# Altium project DDS_Generator.PrjPcb
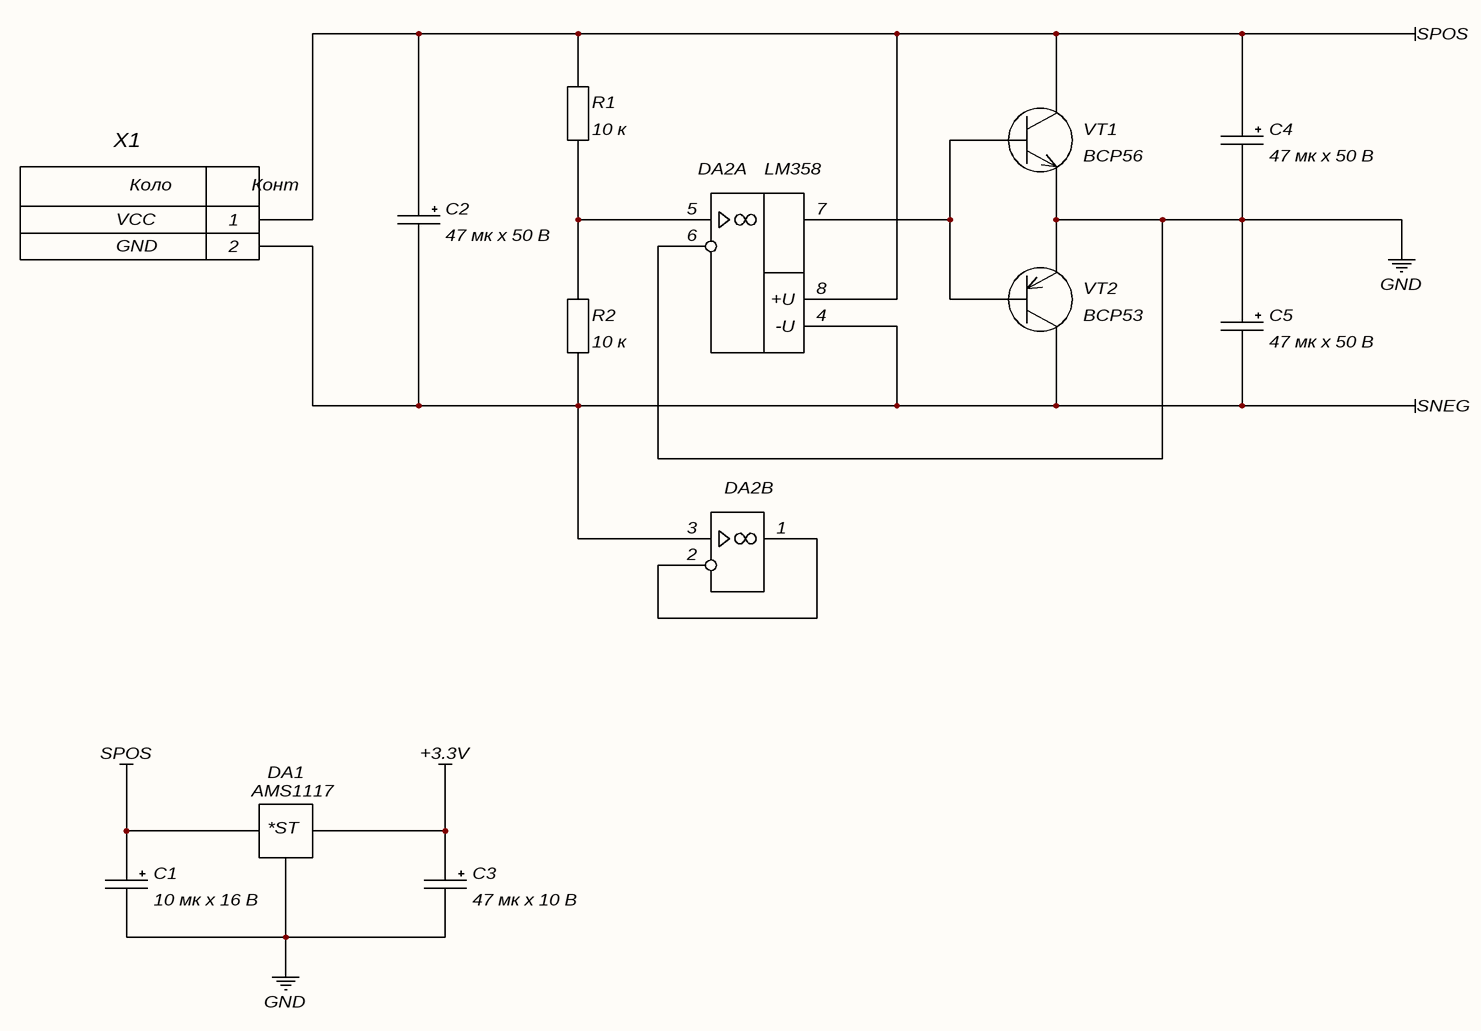
[diagram p0: 1_Power.SchDoc]
Документация0: А2#РІ91.468789.001 СК#Сборочный чертеж (СБ)#СБ##; Документация1: А2#РІ91.468789.001 ЕЗ#Схема электрическая принципиальная (Э3)#Э3##; Материалы0: Паста паяльная 7020 ТУ-005-00387275-2007 (г)##г##; Материалы1: Припой ПОС-61 ГОСТ 21931-76 (г)##г##
3 sheets, 69 parts. Net scope: global (net labels, ports and power ports of the same name join across sheets).
Board file: DDS_Generator.PcbDoc
Sheets:
  1_Power.SchDoc
  2_MCU.SchDoc
  3_RF.SchDoc

## Sheet 1_Power.SchDoc
size 420 x 297 mm; SheetNumber: 1; SheetTotal: 3; Rozrobyv: Іванченко А.; Pereviryv: Адаменко Ю.; Zatverdyv: Адаменко Ю.; Oboznachennia: РІ91.468789.001 Е3; Naymenuvannya: Генератор прямого; Pershzastos: {Перш. застос.}; SpravNo: {Справ. №}; Naymenuvannya2: цифрового синтезу; MisceVudannya: НТУУ КПІ, РТФ, РІ-91; Naymenuvannya3: Схема електрична принципова

### Parts
C1  10 16: 10 мк х 16 В  [CAP: TANTAL-A]  (hidden comment: 10u 16V)
C2  47 50: 47 мк х 50 В  [CAP: SMD D6.3A6.6H7.7]  (hidden comment: 47u 50V)
C3  47 10: 47 мк х 10 В  [CAP: TANTAL-B]  (hidden comment: 47u 10V)
C4  47 50: 47 мк х 50 В  [CAP: SMD D6.3A6.6H7.7]  (hidden comment: 47u 50V)
C5  47 50: 47 мк х 50 В  [CAP: SMD D6.3A6.6H7.7]  (hidden comment: 47u 50V)
DA1  AMS1117  [SOT-223]
DA2  LM358  [8-SOIC]  (parts A,B of 2)
R1  10k  [RES: 0805]  (value not drawn)
R2  10k  [RES: 0805]  (value not drawn)
VT1  BCP56  [SOT-223]
VT2  BCP53  [SOT-223]
X1  PJ002  [CON: PJ002]  (value not drawn)

### Nets
+3.3V: C3.1 DA1.2(Vout)
GND: C1.2 C3.2 C4.2 C5.1 DA1.1(GND) DA2.6(-IN1) VT1.3(e) VT2.3(e)
SNEG: C2.2 C5.2 DA2.3(+IN2) DA2.4(-U) R2.1 VT2.2(k) X1.2
SPOS: C1.1 C2.1 C4.1 DA1.3(Vin) DA2.8(+U) R1.2 VT1.2(k) X1.1
NetDA2_1: DA2.1(OUT2) DA2.2(-IN2)
NetDA2_5: DA2.5(+IN1) R1.1 R2.2
NetDA2_7: DA2.7(OUT1) VT1.1(b) VT2.1(b)

### Notes on the sheet
- Перш. застос.
- Справ. №
- Зм.
- Лист
- № докум.
- Підпис
- Дата
- Літ.
- Маса
- Масштаб
- Т. контр.
- Розроб.
- Перев.
- Листів
- Н. контр.
- Затв.
- Копіював:
- Формат А3
- (in symbol AMS1117) *ST
- (in symbol DC Jack) Коло; Конт; VCC; GND

### Library data of the parts
C1 = Capacitor_polar: Polarity; 470 6,3: 470 мк х 6,3 В; 2200 35: 2200 мк x 35 В; 100 16: 100 мк х 16 В; 0.1 400: 0,1 мк х 400 В; 2.2 16: 2,2 мк х 16 В; 1 16: 1 мк х 16 В; 47 50: 47 мк х 50 В; 47 10: 47 мк х 10 В
C2 C4 C5 = Capacitor_polar: Polarity; 470 6,3: 470 мк х 6,3 В; 2200 35: 2200 мк x 35 В; 100 16: 100 мк х 16 В; 0.1 400: 0,1 мк х 400 В; 10 16: 10 мк х 16 В; 2.2 16: 2,2 мк х 16 В; 1 16: 1 мк х 16 В; 47 10: 47 мк х 10 В
C3 = Capacitor_polar: Polarity; 470 6,3: 470 мк х 6,3 В; 2200 35: 2200 мк x 35 В; 100 16: 100 мк х 16 В; 0.1 400: 0,1 мк х 400 В; 10 16: 10 мк х 16 В; 2.2 16: 2,2 мк х 16 В; 1 16: 1 мк х 16 В; 47 50: 47 мк х 50 В
DA1 = AMS1117: 3.3V Voltage; pin to pad: 2>4; Model: AMS1117
DA2 = Op Amp: ComponentLink1Description: Datasheet; ComponentLink1URL: https://www.analog.com/media/en/technical-documentation/data-sheets/AD8065_8066.pdf; LM358: LM358; AD8066: AD8066
R1 R2 = Resistor: 220: 220; 1 к: 1 к; 3,3 к: 3,3 к; 9,1 к: 9,1 к; 200: 200; 50: 50; 510 к: 510 к; 10 к: 10 к; 0: 0
VT1 = Transistor NPN: pin to pad: 2>2+4; Model: BCP56
VT2 = Transistor PNP: pin to pad: 2>2+4; Model: BCP53
X1 = DC Jack: pin to pad: 2>2+3

## Sheet 2_MCU.SchDoc
size 420 x 297 mm; Author: Ivanchenko Andrii; SheetNumber: 2; SheetTotal: 3; Rozrobyv: Іванченко А.; Pereviryv: {Перевірив}; Tkontr: {Т.контр}; Nkontr: {Н. контр.}; Zatverdyv: {Затвердив}; Oboznachennia: РІ91.468789.001 Е3; Naymenuvannya: Генератор прямого; Naymenuvannya2: цифрового синтезу; MisceVudannya: НТУУ КПІ, РТФ, РІ-91; Naymenuvannya3: Схема електрична принципова; Sheet: 2
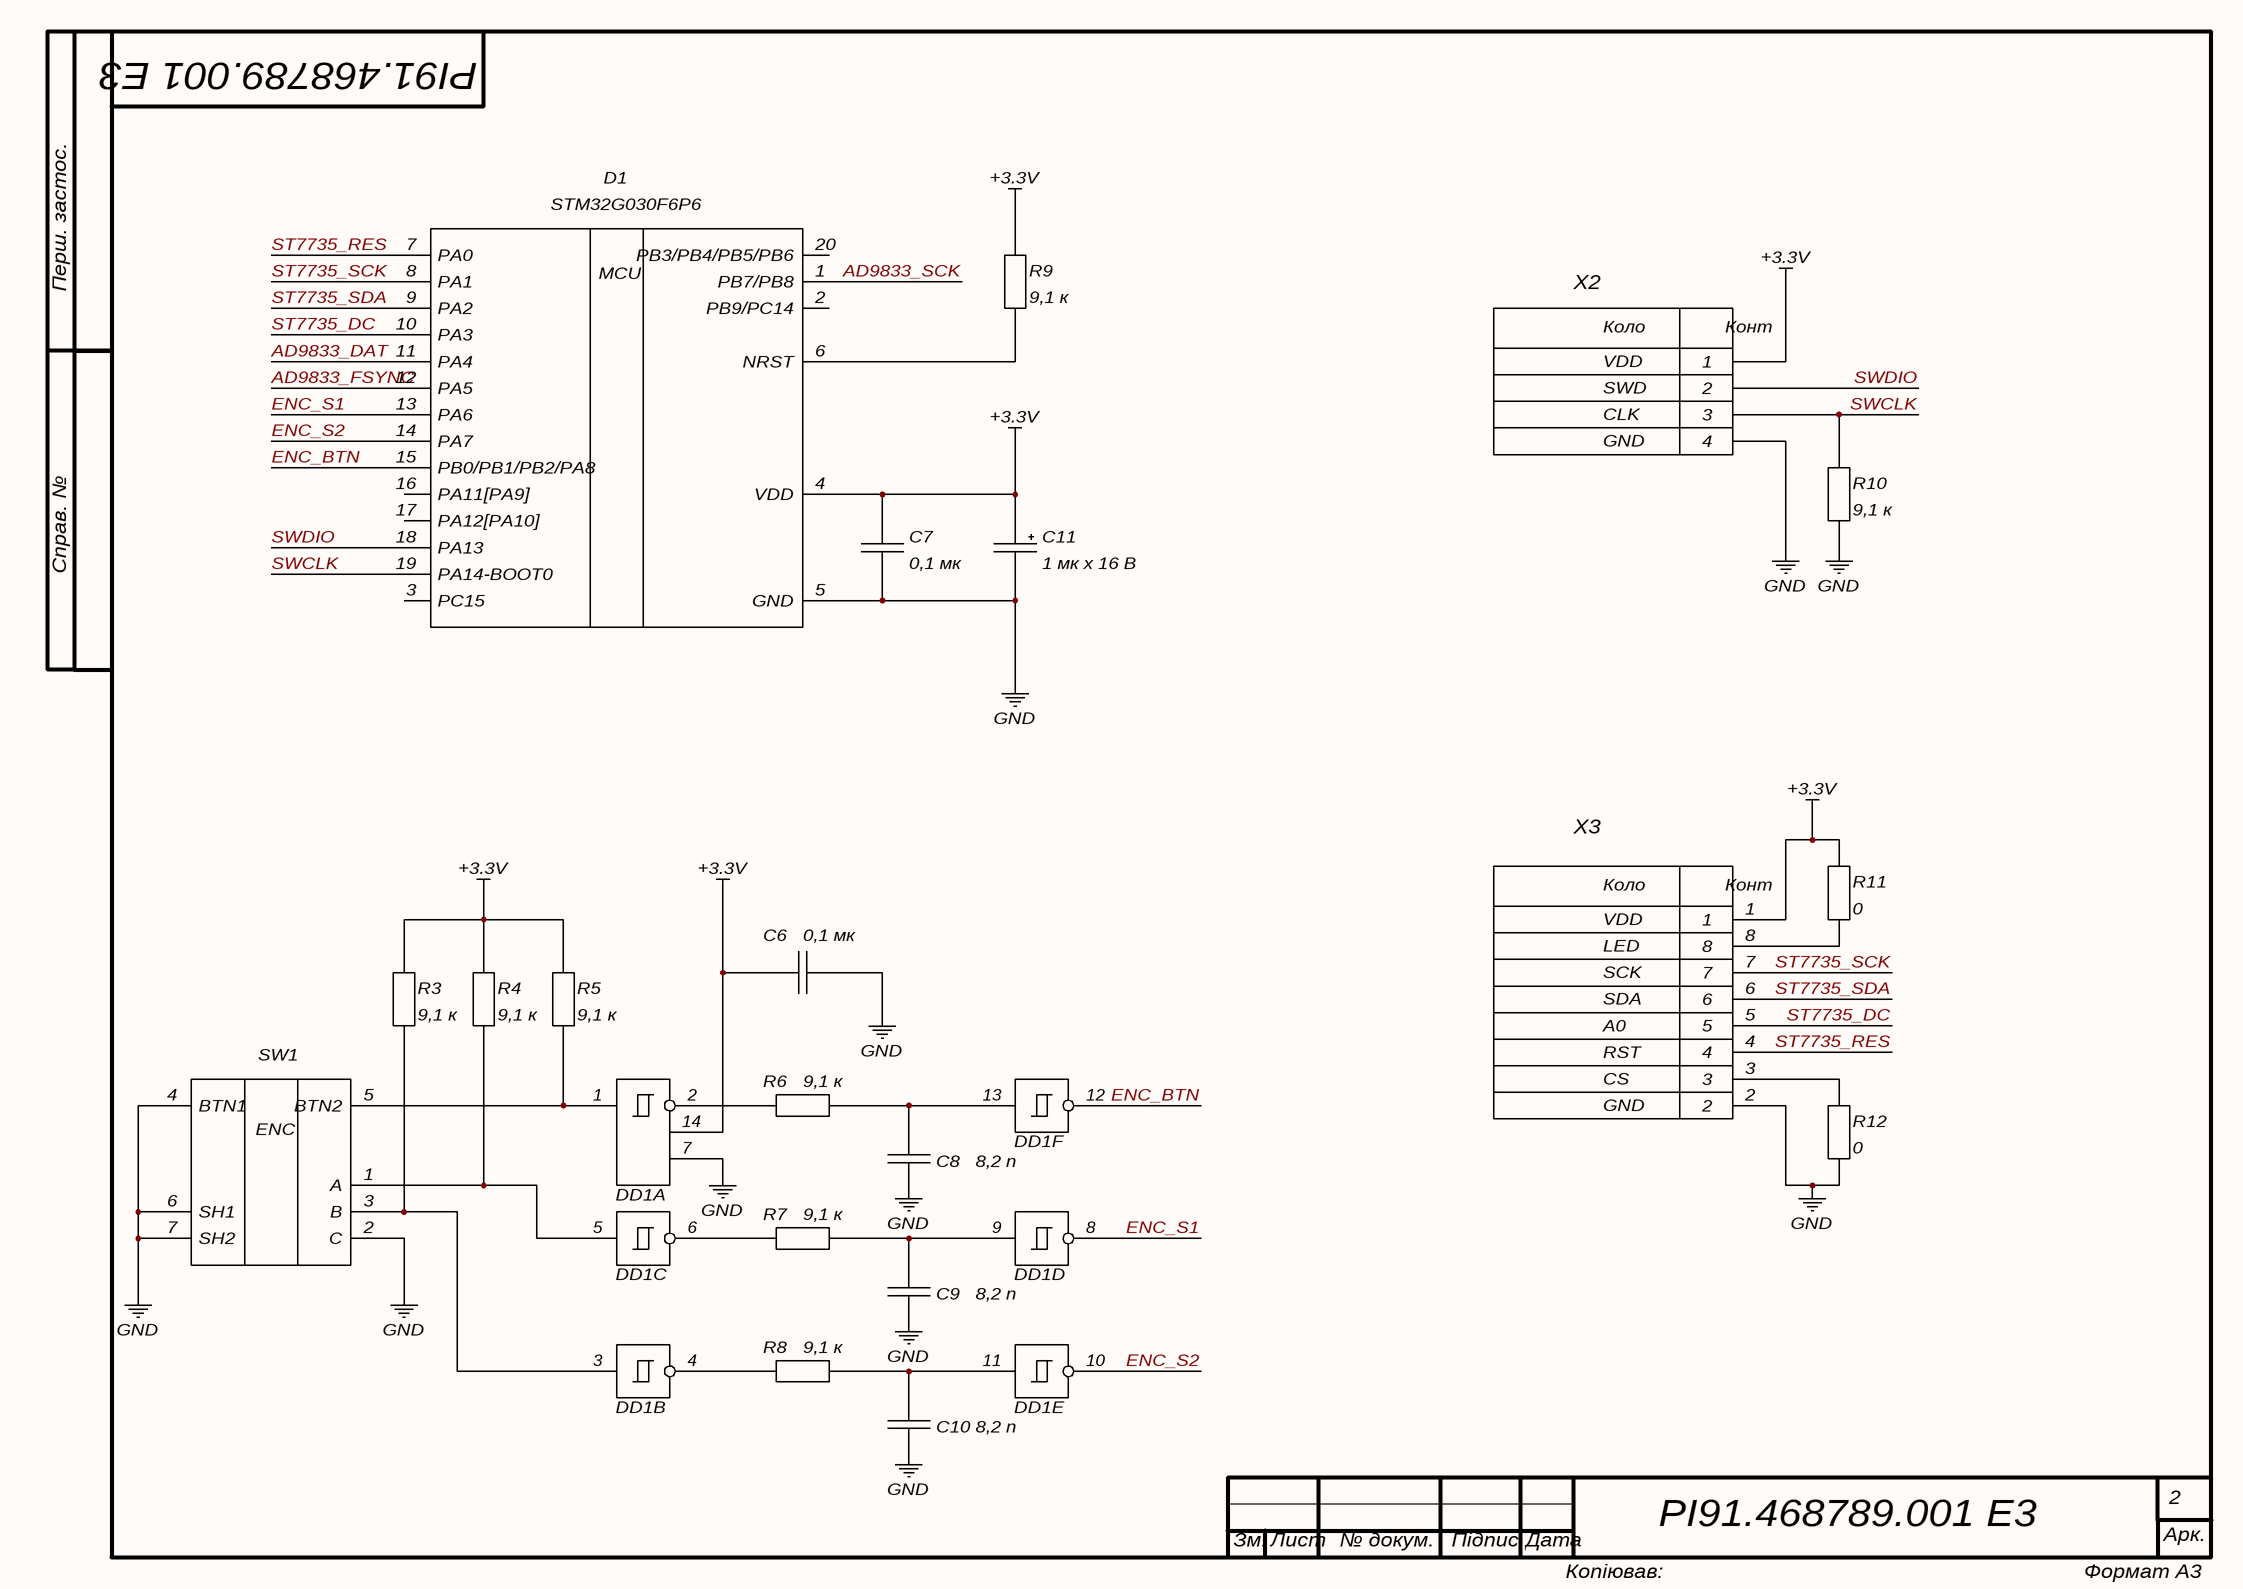
[diagram p1: 2_MCU.SchDoc]

### Parts
C6  0.1u  [CAP: 0603]  (value not drawn)
C7  0.1u  [CAP: 0603]  (value not drawn)
C8  8.2p  [CAP: 0603]  (value not drawn)
C9  8.2p  [CAP: 0603]  (value not drawn)
C10  8.2p  [CAP: 0603]  (value not drawn)
C11  1 16: 1 мк х 16 В  [CAP: TANTAL-A]  (hidden comment: 1u 16V)
D1  STM32G030F6P6  [20-TSSOP]
DD1  SN74HC14  [14-SOIC]  (value not drawn)  (parts A,B,C,D,E,F of 6)
R3  9.1k  [RES: 0603]  (value not drawn)
R4  9.1k  [RES: 0603]  (value not drawn)
R5  9.1k  [RES: 0603]  (value not drawn)
R6  9.1k  [RES: 0603]  (value not drawn)
R7  9.1k  [RES: 0603]  (value not drawn)
R8  9.1k  [RES: 0603]  (value not drawn)
R9  9.1k  [RES: 0603]  (value not drawn)
R10  9.1k  [RES: 0603]  (value not drawn)
R11  0  [RES: 0603]
R12  0  [RES: 0603]
SW1  EC11  [ENC: EC11]  (value not drawn)
X2  IDC-10MS  [CON: IDC-10MS]  (value not drawn)
X3  ST7735 display  [TFT: 1.8 DISPLAY]  (value not drawn)

### Nets
+3.3V: C6.2 C7.2 C11.1 D1.4(VDD) DD1.14(VCC) R3.2 R4.2 R5.2 R9.2 R11.1 X2.3(1) X3.1
GND: C6.1 C7.1 C8.1 C9.1 C10.1 C11.2 D1.5(GND) DD1.7(GND) R10.1 R12.2 SW1.2(C) SW1.4(BTN1) SW1.6(SH1) SW1.7(SH2) X2.7(4) X3.2
AD9833_DAT: D1.11(PA4)
AD9833_FSYNC: D1.12(PA5)
AD9833_SCK: D1.1(PB7/PB8)
ENC_BTN: D1.15(PB0/PB1/PB2/PA8) DD1.12
ENC_S1: D1.13(PA6) DD1.8
ENC_S2: D1.14(PA7) DD1.10
ST7735_DC: D1.10(PA3) X3.5
ST7735_RES: D1.7(PA0) X3.4
ST7735_SCK: D1.8(PA1) X3.7
ST7735_SDA: D1.9(PA2) X3.6
SWCLK: D1.19(PA14-BOOT0) R10.2 X2.5(3)
SWDIO: D1.18(PA13) X2.9(2)
NetC8_2: C8.2 DD1.13 R6.2
NetC9_2: C9.2 DD1.9 R7.2
NetC10_2: C10.2 DD1.11 R8.2
NetD1_6: D1.6(NRST) R9.1
NetDD1_1: DD1.1 R5.1 SW1.5(BTN2)
NetDD1_2: DD1.2 R6.1
NetDD1_3: DD1.3 R3.1 SW1.3(B)
NetDD1_4: DD1.4 R8.1
NetDD1_5: DD1.5 R4.1 SW1.1(A)
NetDD1_6: DD1.6 R7.1
NetR11_2: R11.2 X3.8
NetR12_1: R12.1 X3.3

Not connected (* = marked no-connect by the designer): D1 2(PB9/PC14) 3(PC15) 16(PA11[PA9]) 17(PA12[PA10]) 20(PB3/PB4/PB5/PB6)

### Notes on the sheet
- Перш. застос.
- Справ. №
- Арк.
- Зм.
- Лист
- № докум.
- Підпис
- Дата
- Копіював:
- Формат А3
- (in symbol Connector Display) Коло; Конт; VDD; LED; SCK; SDA; A0; RST; CS; GND
- (in symbol Connector SWD) Коло; Конт; VDD; SWD; CLK; GND
- (in symbol Encoder) ENC

### Library data of the parts
C6-C10 = Capacitor: Non-polarity; 1 мк: 1 мк; 100 н: 100 н; 470 н: 470 н; 8,2 п: 8,2 п; 0,1 мк: 0,1 мк; 10 н: 10 н; 180 п: 180 п; 300 п: 300 п; 330 п: 330 п; 510 п: 510 п; 270 п: 270 п
C11 = Capacitor_polar: Polarity; 470 6,3: 470 мк х 6,3 В; 2200 35: 2200 мк x 35 В; 100 16: 100 мк х 16 В; 0.1 400: 0,1 мк х 400 В; 10 16: 10 мк х 16 В; 2.2 16: 2,2 мк х 16 В; 47 50: 47 мк х 50 В; 47 10: 47 мк х 10 В
D1 = MCU: Manufacturer: STMicroelectronics; ValueManufacturerPartNumber: IC microcontroller, 32-Bit, Cortex-M0+, 64MHz, 32KB, 8KB, 2...3.6V, -40...+85°C, 20-TSSOP; Supply: 2...3.6V; Speed: 64MHz; CoreSize: 32-Bit; MemoryROM: 32KB; MemoryRAM: 8KB; CoreProcessor: Cortex-M0+; HelpURL: https://www.st.com/en/microcontrollers-microprocessors/stm32g030f6.html; Package: 20-TSSOP; ComponentType: IC microcontroller; Temperature: -40...+85°C; PartNumber: STM32G030F6P6
DD1 = SN74HC14: Schmitt trigger; Model: SN74HC14
R3-R12 = Resistor: 220: 220; 1 к: 1 к; 3,3 к: 3,3 к; 9,1 к: 9,1 к; 200: 200; 50: 50; 510 к: 510 к; 10 к: 10 к; 0: 0
SW1 = Encoder: Rotary Encoder
X2 = Connector SWD: SWD Interface
X3 = Connector Display: TFT Display

## Sheet 3_RF.SchDoc
size 420 x 297 mm; SheetNumber: 3; SheetTotal: 3; Rozrobyv: Іванченко; Pereviryv: {Перевірив}; Tkontr: {Т.контр}; Nkontr: {Н. контр.}; Zatverdyv: {Затвердив}; Oboznachennia: РІ91.468789.001 Е3; Naymenuvannya: Генератор прямого; Naymenuvannya2: цифрового синтезу; MisceVudannya: НТУУ КПІ, РТФ, РІ91; Naymenuvannya3: Схема електрична принципова; Sheet: 3
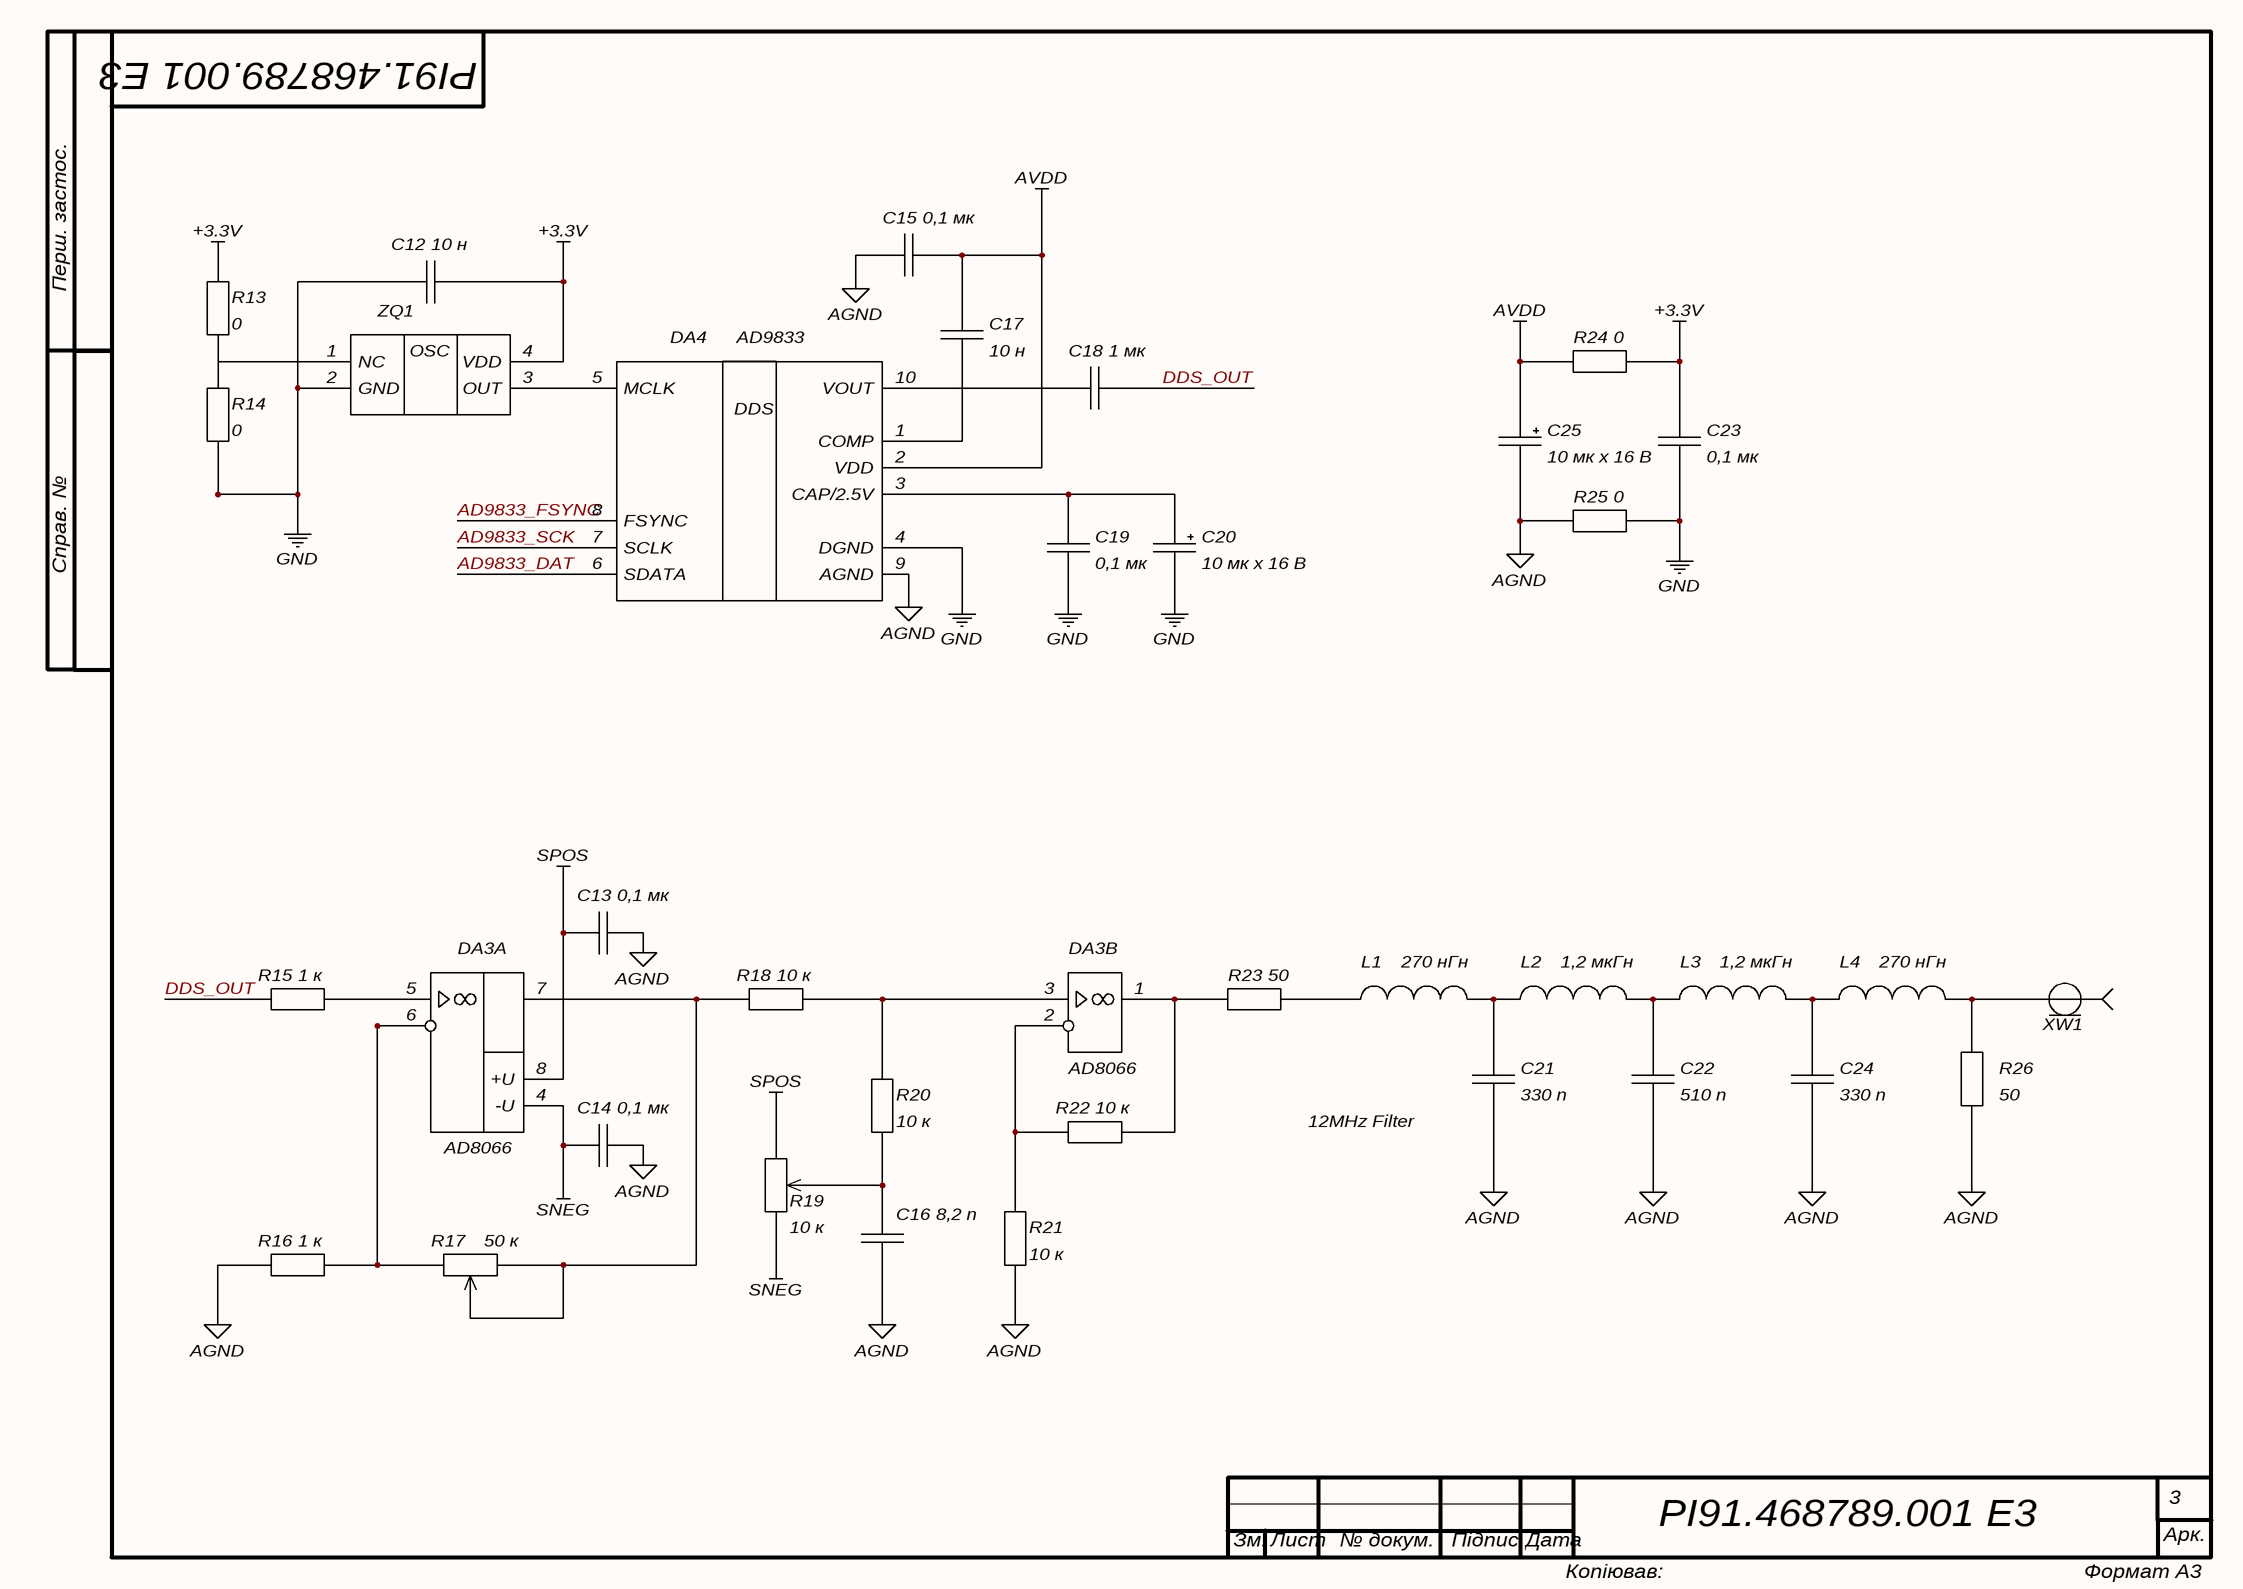
[diagram p2: 3_RF.SchDoc]

### Parts
C12  10n  [CAP: 0603]  (value not drawn)
C13  0.1u  [CAP: 0603]  (value not drawn)
C14  0.1u  [CAP: 0603]  (value not drawn)
C15  0.1u  [CAP: 0603]  (value not drawn)
C16  8.2p  [CAP: 0603]  (value not drawn)
C17  10n  [CAP: 0603]  (value not drawn)
C18  1u 50V  [CAP: 0805]  (value not drawn)
C19  0.1u  [CAP: 0603]  (value not drawn)
C20  10 16: 10 мк х 16 В  [CAP: TANTAL-A]  (hidden comment: 10u 16V)
C21  330p  [CAP: 0805]  (value not drawn)
C22  510p  [CAP: 0805]  (value not drawn)
C23  0.1u  [CAP: 0603]  (value not drawn)
C24  330p  [CAP: 0805]  (value not drawn)
C25  10 16: 10 мк х 16 В  [CAP: TANTAL-A]  (hidden comment: 10u 16V)
DA3  AD8066  [8-SOIC]  (parts A,B of 2)
DA4  AD9833  [10-MSOP]
L1  270n: 270 нГн  [IND: 0805]  (hidden comment: 270nH)
L2  1.2: 1,2 мкГн  [IND: 0805]  (hidden comment: 1.2uH)
L3  1.2: 1,2 мкГн  [IND: 0805]  (hidden comment: 1.2uH)
L4  270n: 270 нГн  [IND: 0805]  (hidden comment: 270nH)
R13  0  [RES: 0603]
R14  0  [RES: 0603]
R15  1k  [RES: 0805]  (value not drawn)
R16  1k  [RES: 0805]  (value not drawn)
R17  50: 50 к  [RES: PTV09A-4015F]  (hidden comment: 10k)
R18  10k  [RES: 0805]  (value not drawn)
R19  10: 10 к  [RES: PTV09A-4015F]  (hidden comment: 10k)
R20  10k  [RES: 0805]  (value not drawn)
R21  10k  [RES: 0805]  (value not drawn)
R22  10k  [RES: 0805]  (value not drawn)
R23  50  [RES: 0805]
R24  0  [RES: 0603]  (net tie, no BOM)
R25  0  [RES: 0603]  (net tie, no BOM)
R26  50  [RES: 0805]
XW1  SMA Edge  [CON: SMA EDGE MOUNT]  (value not drawn)
ZQ1  25 MHz  [OSC: 5070G]  (value not drawn)

### Nets
+3.3V: C12.2 C23.2 R13.2 R24.1 ZQ1.4(VDD)
AGND: C13.2 C14.2 C15.2 C16.1 C21.1 C22.1 C24.1 C25.2 DA4.9(AGND) R16.1 R21.1 R25.2 R26.1
AVDD: C15.1 C17.1 C25.1 DA4.2(VDD) R24.2
GND: C12.1 C19.1 C20.2 C23.1 DA4.4(DGND) R14.1 R25.1 ZQ1.2(GND)
SNEG: C14.1 DA3.4(-U) R19.3
SPOS: C13.1 DA3.8(+U) R19.1
AD9833_DAT: DA4.6(SDATA)
AD9833_FSYNC: DA4.8(FSYNC)
AD9833_SCK: DA4.7(SCLK)
DDS_OUT: C18.2 R15.1
NetC16_2: C16.2 R19.2 R20.1
NetC17_2: C17.2 DA4.1(COMP)
NetC18_1: C18.1 DA4.10(VOUT)
NetC19_2: C19.2 C20.1 DA4.3(CAP/2.5V)
NetC21_2: C21.2 L1.2 L2.1
NetC22_2: C22.2 L2.2 L3.1
NetC24_2: C24.2 L3.2 L4.1
NetDA3_1: DA3.1(OUT2) R22.1 R23.2
NetDA3_2: DA3.2(-IN2) R21.2 R22.2
NetDA3_3: DA3.3(+IN2) R18.2 R20.2
NetDA3_5: DA3.5(+IN1) R15.2
NetDA3_6: DA3.6(-IN1) R16.2 R17.3
NetDA3_7: DA3.7(OUT1) R17.1 R17.2 R18.1
NetDA4_5: DA4.5(MCLK) ZQ1.3(OUT)
NetL1_1: L1.1 R23.1
NetL4_2: L4.2 R26.2 XW1.1(SIG)
NetR13_1: R13.1 R14.2 ZQ1.1(NC)

### Notes on the sheet
- 12MHz Filter
- Перш. застос.
- Справ. №
- Арк.
- Зм.
- Лист
- № докум.
- Підпис
- Дата
- Копіював:
- Формат А3
- (in symbol AD9833) DDS
- (in symbol Oscillator) OSC

### Library data of the parts
C12-C19 C21-C24 = Capacitor: Non-polarity; 1 мк: 1 мк; 100 н: 100 н; 470 н: 470 н; 8,2 п: 8,2 п; 0,1 мк: 0,1 мк; 10 н: 10 н; 180 п: 180 п; 300 п: 300 п; 330 п: 330 п; 510 п: 510 п; 270 п: 270 п
C20 C25 = Capacitor_polar: as C1 on sheet 1_Power
DA3 = Op Amp: ComponentLink1Description: Datasheet; ComponentLink1URL: https://www.analog.com/media/en/technical-documentation/data-sheets/AD8065_8066.pdf; LM358: LM358; AD8066: AD8066
DA4 = AD9833: DDS Generator; ComponentLink1Description: Datasheet; ComponentLink1URL: https://www.analog.com/media/en/technical-documentation/data-sheets/ad9833.pdf
L1 L4 = Inductor: 1.2: 1,2 мкГн; 330n: 330 нГн
L2 L3 = Inductor: 330n: 330 нГн; 270n: 270 нГн
R13-R16 R18 R20-R26 = Resistor: 220: 220; 1 к: 1 к; 3,3 к: 3,3 к; 9,1 к: 9,1 к; 200: 200; 50: 50; 510 к: 510 к; 10 к: 10 к; 0: 0
R17 = Potentiometer: 10: 10 к
R19 = Potentiometer: 50: 50 к
XW1 = Connector RF
ZQ1 = Oscillator

## Nets that join several sheets
+3.3V: 1_Power (C3.1 DA1.2), 2_MCU (12 pins), 3_RF (5 pins)
GND: 1_Power (8 pins), 2_MCU (16 pins), 3_RF (8 pins)
SNEG: 1_Power (7 pins), 3_RF (C14.1 DA3.4 R19.3)
SPOS: 1_Power (8 pins), 3_RF (C13.1 DA3.8 R19.1)
AD9833_DAT: 2_MCU (D1.11), 3_RF (DA4.6)
AD9833_FSYNC: 2_MCU (D1.12), 3_RF (DA4.8)
AD9833_SCK: 2_MCU (D1.1), 3_RF (DA4.7)